# Altium schematic sheet cpuinterface.SchDoc
size A4
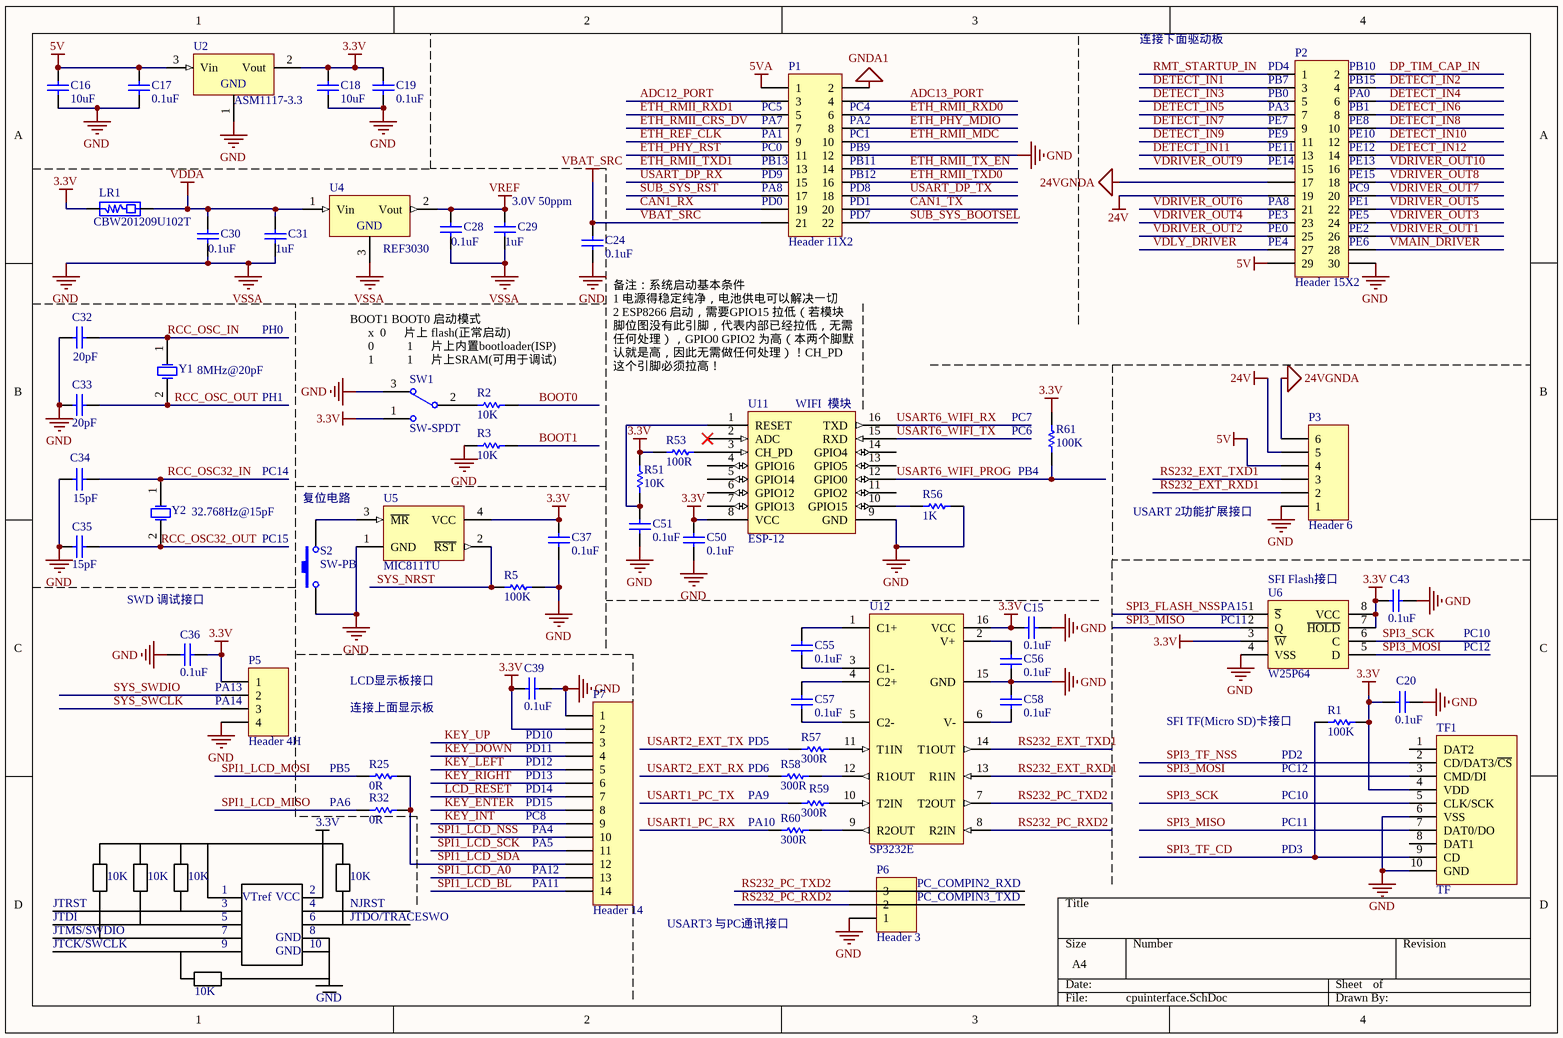
[diagram p0: cpuinterface.SchDoc]

## Parts
C15  0.1uF  [CAPC2012M]
C16  10uF  [CAPC2012M]
C17  0.1uF  [CAPC2012M]
C18  10uF  [CAPC2012M]
C19  0.1uF  [CAPC2012M]
C20  0.1uF  [CAPC2012M]
C24  0.1uF  [CAPC2012M]
C28  0.1uF  [CAPC2012M]
C29  1uF  [CAPC2012M]
C30  0.1uF  [CAPC2012M]
C31  1uF  [CAPC2012M]
C32  20pF  [CAPC2012M]
C33  20pF  [CAPC2012M]
C34  15pF  [CAPC2012M]
C35  15pF  [CAPC2012M]
C36  0.1uF  [CAPC2012M]
C37  0.1uF  [CAPC2012M]
C39  0.1uF  [CAPC2012M]
C43  0.1uF  [CAPC2012M]
C50  0.1uF  [CAPC2012M]
C51  0.1uF  [CAPC2012M]
C55  0.1uF  [CAPC2012M]
C56  0.1uF  [CAPC2012M]
C57  0.1uF  [CAPC2012M]
C58  0.1uF  [CAPC2012M]
LR1  CBW201209U102T  [INDC2012M]
P1  Header 11X2  [HDR2X11]
P2  Header 15X2  [HDR2X15]
P3  Header 6  [HDR1x6-2.0]
P5  Header 4H  [HDR1X4H-2.0]
P6  Header 3  [HDR1x3-2.0]
P7  Header 14  [FPC0.5-14P-A]
R1  100K  [RESC2012M]
R2  10K  [RESC2012M]
R3  10K  [RESC2012M]
R5  100K  [RESC2012M]
R25  0R  [RESC2012M]
R32  0R  [RESC2012M]
R51  10K  [RESC2012M]
R53  100R  [RESC2012M]
R56  1K  [RESC2012M]
R57  300R  [RESC2012M]
R58  300R  [RESC2012M]
R59  300R  [RESC2012M]
R60  300R  [RESC2012M]
R61  100K  [RESC2012M]
S2  SW-PB  [PBSMT-6x3x3.5R]
SW1  SW-SPDT  [SW-9x3.5x3.5RS]
TF1  TF  [TF-PUSH]
U2  ASM1117-3.3  [SOT-223]
U4  REF3030  [SOT23_M]
U5  MIC811TU  [SOT-143_N]
U6  W25P64  [SOIC8_W]
U11  ESP-12  [ESP-12]
U12  SP3232E  [NSO16_M]
Y1  8MHz@20pF  [HC-49U]
Y2  32.768Hz@15pF  [HC-RTC-L]

## Nets
3.3V: C15.2 C18.2 C19.2 C20.1 C36.2 C37.2 C39.2 C43.1 C50.1 LR1.1 P5.1 P7.2 R1.2 R51.1 R53.1 R61.1 SW1.1 TF1.4(VDD) U2.2(Vout) U5.4(VCC) U6.3(~{W}) U6.7(~{HOLD}) U6.8(VCC) U11.8(VCC) U12.16(VCC)
5V: C16.2 C17.2 P2.29 P3.4 U2.3(Vin)
5VA: P1.1
24V: P2.19 P3.5
24VGNDA: P2.17 P3.6
GND: C15.1 C16.1 C17.1 C18.1 C19.1 C20.2 C24.2 C28.1 C29.1 C30.1 C31.1 C32.2 C33.2 C34.2 C35.2 C36.1 C37.1 C39.1 C43.2 C50.2 C51.2 C56.1 C58.2 P1.12 P2.30 P3.1 P5.4 P6.1 P7.1 R3.2 R5.2 R56.1 S2.1 SW1.3 TF1.6(VSS) TF1.10(GND) U2.1(GND) U4.3(GND) U5.1(GND) U6.4(VSS) U11.9(GND) U12.15(GND)  [also labelled VSSA]
GNDA1: P1.2
VBAT_SRC: C24.1 P1.21
VDDA: C30.2 C31.2 LR1.2 U4.1(Vin)
VREF: C28.2 C29.2 U4.2(Vout)
ADC12_PORT: P1.3
ADC13_PORT: P1.4
BOOT0: R2.1
BOOT1: R3.1
CAN1_RX: P1.19
CAN1_TX: P1.20
DETECT_IN1: P2.3
DETECT_IN2: P2.4
DETECT_IN3: P2.5
DETECT_IN4: P2.6
DETECT_IN5: P2.7
DETECT_IN6: P2.8
DETECT_IN7: P2.9
DETECT_IN8: P2.10
DETECT_IN9: P2.11
DETECT_IN10: P2.12
DETECT_IN11: P2.13
DETECT_IN12: P2.14
DP_TIM_CAP_IN: P2.2
ETH_PHY_MDIO: P1.8
ETH_PHY_RST: P1.11
ETH_REF_CLK: P1.9
ETH_RMII_CRS_DV: P1.7
ETH_RMII_MDC: P1.10
ETH_RMII_RXD0: P1.6
ETH_RMII_RXD1: P1.5
ETH_RMII_TX_EN: P1.14
ETH_RMII_TXD0: P1.16
ETH_RMII_TXD1: P1.13
KEY_DOWN: P7.4
KEY_ENTER: P7.8
KEY_INT: P7.9
KEY_LEFT: P7.5
KEY_RIGHT: P7.6
KEY_UP: P7.3
LCD_RESET: P7.7
RCC_OSC32_IN: C34.1 Y2.1(OSC1)
RCC_OSC32_OUT: C35.1 Y2.2(OSC2)
RCC_OSC_IN: C32.1 Y1.1(OSC1)
RCC_OSC_OUT: C33.1 Y1.2(OSC2)
RMT_STARTUP_IN: P2.1
RS232_EXT_RXD1: P3.2 U12.13(R1IN)
RS232_EXT_TXD1: P3.3 U12.14(T1OUT)
RS232_PC_RXD2: P6.2 U12.8(R2IN)
RS232_PC_TXD2: P6.3 U12.7(T2OUT)
SPI1_LCD_A0: P7.13
SPI1_LCD_BL: P7.14
SPI1_LCD_MISO: R32.1
SPI1_LCD_MOSI: R25.1
SPI1_LCD_NSS: P7.10
SPI1_LCD_SCK: P7.11
SPI1_LCD_SDA: P7.12 R25.2 R32.2
SPI3_FLASH_NSS: U6.1(~{S})
SPI3_MISO: TF1.7(DAT0/DO) U6.2(Q)
SPI3_MOSI: TF1.3(CMD/DI) U6.5(D)
SPI3_SCK: TF1.5(CLK/SCK) U6.6(C)
SPI3_TF_CD: R1.1 TF1.9(CD)
SPI3_TF_NSS: TF1.2(CD/DAT3/~{CS})
SUB_SYS_BOOTSEL: P1.22
SUB_SYS_RST: P1.17
SYS_NRST: R5.1 U5.2(~{RST})
SYS_SWCLK: P5.3
SYS_SWDIO: P5.2
USART1_PC_RX: R60.2
USART1_PC_TX: R59.1
USART2_EXT_RX: R58.1
USART2_EXT_TX: R57.1
USART6_WIFI_PROG: R61.2 U11.12(GPIO0)
USART6_WIFI_RX: U11.16(TXD)
USART6_WIFI_TX: U11.15(RXD)
USART_DP_RX: P1.15
USART_DP_TX: P1.18
VDLY_DRIVER: P2.27
VDRIVER_OUT1: P2.26
VDRIVER_OUT2: P2.25
VDRIVER_OUT3: P2.24
VDRIVER_OUT4: P2.23
VDRIVER_OUT5: P2.22
VDRIVER_OUT6: P2.21
VDRIVER_OUT7: P2.20
VDRIVER_OUT8: P2.18
VDRIVER_OUT9: P2.15
VDRIVER_OUT10: P2.16
VMAIN_DRIVER: P2.28
NetC51_1: C51.1 R51.2 U11.1(RESET)
NetC55_1: C55.1 U12.1(C1+)
NetC55_2: C55.2 U12.3(C1-)
NetC56_2: C56.2 U12.2(V+)
NetC57_1: C57.1 U12.5(C2-)
NetC57_2: C57.2 U12.4(C2+)
NetC58_1: C58.1 U12.6(V-)
NetR2_2: R2.2 SW1.2
NetR53_2: R53.2 U11.3(CH_PD)
NetR56_2: R56.2 U11.10(GPIO15)
NetR57_2: R57.2 U12.11(T1IN)
NetR58_2: R58.2 U12.12(R1OUT)
NetR59_2: R59.2 U12.10(T2IN)
NetR60_1: R60.1 U12.9(R2OUT)
NetS2_2: S2.2 U5.3(~{MR})

Not connected (* = marked no-connect by the designer): TF1 1(DAT2) 8(DAT1); U11 2(ADC)* 4(GPIO16) 5(GPIO14) 6(GPIO12) 7(GPIO13) 11(GPIO2) 13(GPIO5) 14(GPIO4)

## Notes on the sheet
- 连接下面驱动板
- (near P1) PC5
- (near P1) PC4
- (near P2) PB7
- (near P2) PD4
- (near P2) PA3
- (near P2) PB0
- (near P2) PB10
- (near P2) PB1
- (near P2) PA0
- (near P2) PB15
- (near P1) PA1
- (near P1) PA7
- (near P1) PB13
- (near P1) PC0
- (near P1) PD9
- (near P1) PA2
- (near P1) PB11
- (near P1) PB12
- (near P1) PC1
- (near P1) PB9
- (near P2) PE14
- (near P2) PE11
- (near P2) PE9
- (near P2) PE7
- (near P2) PE15
- (near P2) PE12
- (near P2) PE13
- (near P2) PE10
- (near P2) PE8
- (near C29) 3.0V 50ppm
- (near P1) PA8
- (near P1) PD0
- (near P1) PD8
- (near P1) PD1
- (near P1) PD7
- (near P2) PE4
- (near P2) PE0
- (near P2) PE3
- (near P2) PA8
- (near P2) PE6
- (near P2) PE2
- (near P2) PE5
- (near P2) PE1
- (near P2) PC9
- PH0
- BOOT1 BOOT0 启动模式
  x	 0      片上 flash(正常启动)
  0           1      片上内置bootloader(ISP)
  1           1      片上SRAM(可用于调试)
- PH1
- 备注：系统启动基本条件
  1 电源得稳定纯净，电池供电可以解决一切
  2 ESP8266 启动，需要GPIO15 拉低（若模块脚位图没有此引脚，代表内部已经拉低，无需任何处理），GPIO0 GPIO2 为高（本两个脚默认就是高，因此无需做任何处理）！CH_PD 这个引脚必须拉高！
- (near U11) WIFI  模块
- (near R61) PC6
- (near R61) PC7
- PC14
- 复位电路
- (near R61) PB4
- USART 2功能扩展接口
- (near S2) PC15
- (near U6) SFI Flash接口
- SWD 调试接口
- (near U6) PC11
- (near U6) PA15
- PC10
- PC12
- (near P5) PA13
- (near P5) PA14
- LCD显示板接口
- 连接上面显示板
- (near R25) PB5
- PD12
- PD11
- PD10
- (near P7) PD13
- (near P7) PD14
- PD5
- (near R58) PD6
- SFI TF(Micro SD)卡接口
- (near R1) PD2
- (near R1) PC12
- (near R32) 3.3V
- PA6
- (near P7) PD15
- (near P7) PC8
- (near P7) PA4
- (near P7) PA5
- (near R60) PA10
- PA9
- PD3
- PC11
- JTRST
- JTDI
- 10K
- 1
- 3
- 5
- VTref
- VCC
- 2
- 4
- 6
- NJRST
- JTDO/TRACESWO
- (near P7) PA11
- (near P7) PA12
- USART3 与PC通讯接口
- PC_COMPIN2_RXD
- PC_COMPIN3_TXD
- JTMS/SWDIO
- JTCK/SWCLK
- 7
- 9
- GND
- 8
- 10

## Library data of the parts
C15-C20 C24 C28-C31 C36 C37 C39 C43 C50 C51 C55-C58 = Cap: Capacitor; Value: 1nF; Published: 8-Jun-2000; LatestRevisionDate: 17-Jul-2002; LatestRevisionNote: Re-released for DXP Platform.; PackageReference: RAD-0.3; Publisher: Altium Limited
C32-C35 = Cap: Capacitor; Value: 100pF; Published: 8-Jun-2000; LatestRevisionDate: 17-Jul-2002; LatestRevisionNote: Re-released for DXP Platform.; PackageReference: RAD-0.3; Publisher: Altium Limited
LR1 = BLM10/11/21/31/41: EMI FILTERS,DC Resistance max.0.05~1.5 ohms,10 ~ 1000 ohms at 100MHz  Frequency
P1 = Header 11X2: Header, 11-Pin, Dual row; LatestRevisionDate: 17-Jul-2002; LatestRevisionNote: Re-released for DXP Platform.; Publisher: Altium Limited
P2 = Header 15X2: Header, 15-Pin, Dual row; LatestRevisionDate: 17-Jul-2002; LatestRevisionNote: Re-released for DXP Platform.; Publisher: Altium Limited
P3 = Header 6: Header, 6-Pin; LatestRevisionDate: 17-Jul-2002; LatestRevisionNote: Re-released for DXP Platform.; Publisher: Altium Limited
P5 = Header 4H: Header, 4-Pin, Right Angle; LatestRevisionDate: 17-Jul-2002; LatestRevisionNote: Re-released for DXP Platform.; Publisher: Altium Limited
P6 = Header 3: Header, 3-Pin; LatestRevisionDate: 17-Jul-2002; LatestRevisionNote: Re-released for DXP Platform.; Publisher: Altium Limited
P7 = Header 14: Header, 14-Pin; LatestRevisionDate: 17-Jul-2002; LatestRevisionNote: Re-released for DXP Platform.; Publisher: Altium Limited
R1 R5 R25 R32 R53 R56-R61 = Res1: Resistor; Value: 10K; Published: 8-Jun-2000; LatestRevisionDate: 17-Jul-2002; LatestRevisionNote: Re-released for DXP Platform.; PackageReference: AXIAL-0.3; Publisher: Altium Limited
R2 R3 R51 = Res1: Resistor; Published: 8-Jun-2000; LatestRevisionDate: 17-Jul-2002; LatestRevisionNote: Re-released for DXP Platform.; PackageReference: AXIAL-0.3; Publisher: Altium Limited; Value: 10K
S2 = SW-PB: Push Button ,2mm(L)x2mm(W)x10mm(H); Published: 24-Mar-1999; LatestRevisionDate: 17-Jul-2002; LatestRevisionNote: Re-released for DXP Platform.; PackageReference: SPST-2; Publisher: Altium Limited
SW1 = SW-SPDT_1: 开关; Published: 24-Mar-1999; LatestRevisionDate: 17-Dec-2003; LatestRevisionNote: Schematic revised, PCB Footprint replaced.; DatasheetDocument: 05-Dec-2000; PackageReference: TL36WW15050; Publisher: Altium Limited; ComponentLink1Description: Manufacturer Link; ComponentLink1URL: http://www.apem.com
U2 = LM1117T-5.0: 800mA Low-Dropout Linear Regulator
U4 = REF3330: 1.25V 1.8V 2.048V 2.5V 3.0V 3.3V 4.096V reference voltage
U5 = MAX811-EUS-T: 4-Pin 礟 Voltage Monitors with Manual Reset Input; Published: 16-Jan-2001; LatestRevisionDate: 29-May-2009; LatestRevisionNote: IPC-7351 Footprint Added.; DatasheetVersion: Feb-1998; PackageVersion: Feb-1998; PackageReference: SOT143; Publisher: Altium Limited; PackageDescription: 4-Pin SOT-143 Package 1.9 mm Pitch, 2.3 mm Lead Span; ComponentLink1Description: Manufacturer Link; ComponentLink1URL: http://www.maxim-ic.com/; ComponentLink2Description: Datasheet; ComponentLink2URL: http://pdfserv.maxim-ic.com/en/ds/MAX811-MAX812.pdf
U6 = M25P32: 32 Mbit, Low Voltage, Serial Flash Memory  With 50MHz SPI Bus Interface
U11 = ESP-12: SOC Wifi Mode
U12 = SP3232E: +3.0V+5V Powered, Multi-Channel RS-232 Driver/Receiver; Published: 16-Jan-2001; LatestRevisionDate: 13-Apr-2006; LatestRevisionNote: IPC-7351 Footprint Added.; PackageReference: NSO16; Publisher: Altium Limited; PackageDescription: 16-Pin Small Outline Integrated Circuit 1.27 mm Pitch; Code_JEDEC: MS-012-AC; Code_IPC: SOIC127P600-16; ComponentLink1Description: Manufacturer Link; ComponentLink1URL: http://www.maxim-ic.com/; ComponentLink2Description: Datasheet; ComponentLink2URL: http://pdfserv.maxim-ic.com/en/ds/MAX220-MAX249.pdf
Y1 Y2 = XTAL: Crystal Oscillator; Published: 8-Jun-2000; LatestRevisionDate: 17-Jul-2002; LatestRevisionNote: Re-released for DXP Platform.; PackageReference: R38; Publisher: Altium Limited